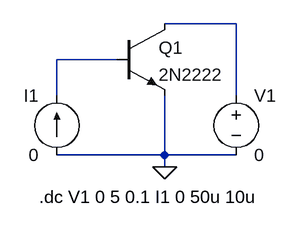
[diagram p0: schematic s1041555-hw2.asc]
s1041555-hw2.asc, the LTspice schematic file:
Version 4
SHEET 1 880 680
WIRE 384 16 288 16
WIRE 224 64 144 64
WIRE 144 112 144 64
WIRE 384 112 384 16
WIRE 288 192 288 112
WIRE 288 192 144 192
WIRE 384 192 288 192
WIRE 288 208 288 192
FLAG 288 208 0
SYMBOL current 144 192 R180
WINDOW 0 24 80 Left 2
WINDOW 3 24 0 Left 2
WINDOW 123 0 0 Left 2
WINDOW 39 0 0 Left 2
SYMATTR InstName I1
SYMATTR Value 0
SYMBOL npn 224 16 R0
SYMATTR InstName Q1
SYMATTR Value 2N2222
SYMBOL voltage 384 96 R0
WINDOW 123 0 0 Left 2
WINDOW 39 0 0 Left 2
SYMATTR InstName V1
SYMATTR Value 0
TEXT 120 248 Left 2 !.dc V1 0 5 0.1 I1 0 50u 10u

The netlist it stands for:
* s1041555-hw2.asc
I1 0 N002 0
Q1 N001 N002 0 0 2N2222
V1 N001 0 0
.model NPN NPN
.model PNP PNP
.lib standard.bjt
.dc V1 0 5 0.1 I1 0 50u 10u
.backanno
.end